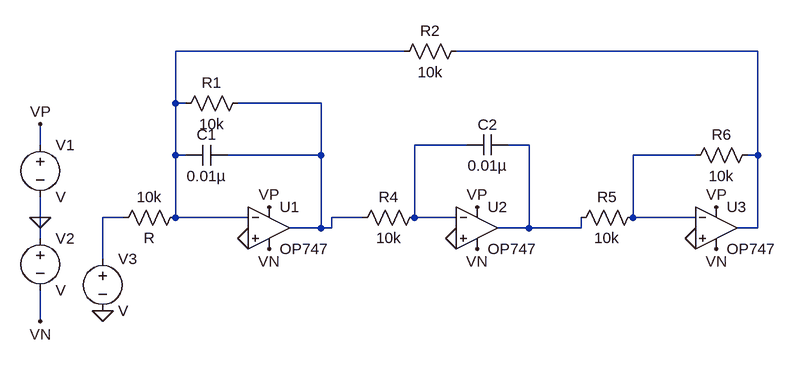
[diagram p0: schematic TOW_THOMAS_BIQUAD_FILTER.asc]
TOW_THOMAS_BIQUAD_FILTER.asc, the LTspice schematic file:
Version 4
SHEET 1 880 680
WIRE 256 -64 -96 -64
WIRE 800 -64 336 -64
WIRE -96 16 -96 -64
WIRE -80 16 -96 16
WIRE 128 16 0 16
WIRE -304 80 -304 48
WIRE 352 80 272 80
WIRE 448 80 416 80
WIRE -96 96 -96 16
WIRE -80 96 -96 96
WIRE 128 96 128 16
WIRE 128 96 -16 96
WIRE 704 96 608 96
WIRE 800 96 800 -64
WIRE 800 96 784 96
WIRE -304 192 -304 160
WIRE -176 192 -208 192
WIRE -96 192 -96 96
WIRE 16 192 -96 192
WIRE 192 192 144 192
WIRE 272 192 272 80
WIRE 336 192 272 192
WIRE 608 192 608 96
WIRE 704 192 608 192
WIRE 128 208 128 96
WIRE 128 208 80 208
WIRE 144 208 144 192
WIRE 144 208 128 208
WIRE 448 208 448 80
WIRE 448 208 400 208
WIRE 528 208 528 192
WIRE 528 208 448 208
WIRE 800 208 800 96
WIRE 800 208 768 208
WIRE -304 224 -304 192
WIRE -208 256 -208 192
WIRE -304 352 -304 304
FLAG -304 192 0
FLAG -304 48 VP
FLAG -304 352 VN
FLAG 48 176 VP
FLAG 368 176 VP
FLAG 736 176 VP
FLAG 48 240 VN
FLAG 368 240 VN
FLAG 736 240 VN
FLAG 16 224 0
FLAG 336 224 0
FLAG 704 224 0
FLAG -208 336 0
SYMBOL OpAmps\\OP747 48 144 R0
SYMATTR InstName U1
SYMBOL OpAmps\\OP747 368 144 R0
SYMATTR InstName U2
SYMBOL OpAmps\\OP747 736 144 R0
SYMATTR InstName U3
SYMBOL voltage -304 64 R0
SYMATTR InstName V1
SYMBOL voltage -304 208 R0
SYMATTR InstName V2
SYMBOL res 16 0 R90
WINDOW 0 0 56 VBottom 2
WINDOW 3 32 56 VTop 2
SYMATTR InstName R1
SYMATTR Value 10k
SYMBOL res 352 -80 R90
WINDOW 0 0 56 VBottom 2
WINDOW 3 32 56 VTop 2
SYMATTR InstName R2
SYMATTR Value 10k
SYMBOL res -80 176 R90
WINDOW 0 0 56 VBottom 2
WINDOW 3 32 56 VTop 2
SYMATTR InstName 10k
SYMBOL res 288 176 R90
WINDOW 0 0 56 VBottom 2
WINDOW 3 32 56 VTop 2
SYMATTR InstName R4
SYMATTR Value 10k
SYMBOL res 624 176 R90
WINDOW 0 0 56 VBottom 2
WINDOW 3 32 56 VTop 2
SYMATTR InstName R5
SYMATTR Value 10k
SYMBOL res 800 80 R90
WINDOW 0 0 56 VBottom 2
WINDOW 3 32 56 VTop 2
SYMATTR InstName R6
SYMATTR Value 10k
SYMBOL cap -16 80 R90
WINDOW 0 0 32 VBottom 2
WINDOW 3 32 32 VTop 2
SYMATTR InstName C1
SYMATTR Value 0.01µ
SYMBOL cap 416 64 R90
WINDOW 0 0 32 VBottom 2
WINDOW 3 32 32 VTop 2
SYMATTR InstName C2
SYMATTR Value 0.01µ
SYMBOL voltage -208 240 R0
SYMATTR InstName V3

The netlist it stands for:
* TOW_THOMAS_BIQUAD_FILTER.asc
XU1 0 N001 VP VN N003 OP747  ; pins In+ In- V+ V- OUT
XU2 0 N004 VP VN N005 OP747  ; pins In+ In- V+ V- OUT
XU3 0 N006 VP VN N002 OP747  ; pins In+ In- V+ V- OUT
V1 VP 0 V
V2 0 VN V
R1 N003 N001 10k
R2 N002 N001 10k
R§10k N001 N007 R
R4 N004 N003 10k
R5 N006 N005 10k
R6 N002 N006 10k
C1 N003 N001 0.01µ
C2 N005 N004 0.01µ
V3 N007 0 V
.backanno
.end